# EAGLE design schematic (EAGLE 9.0.0)
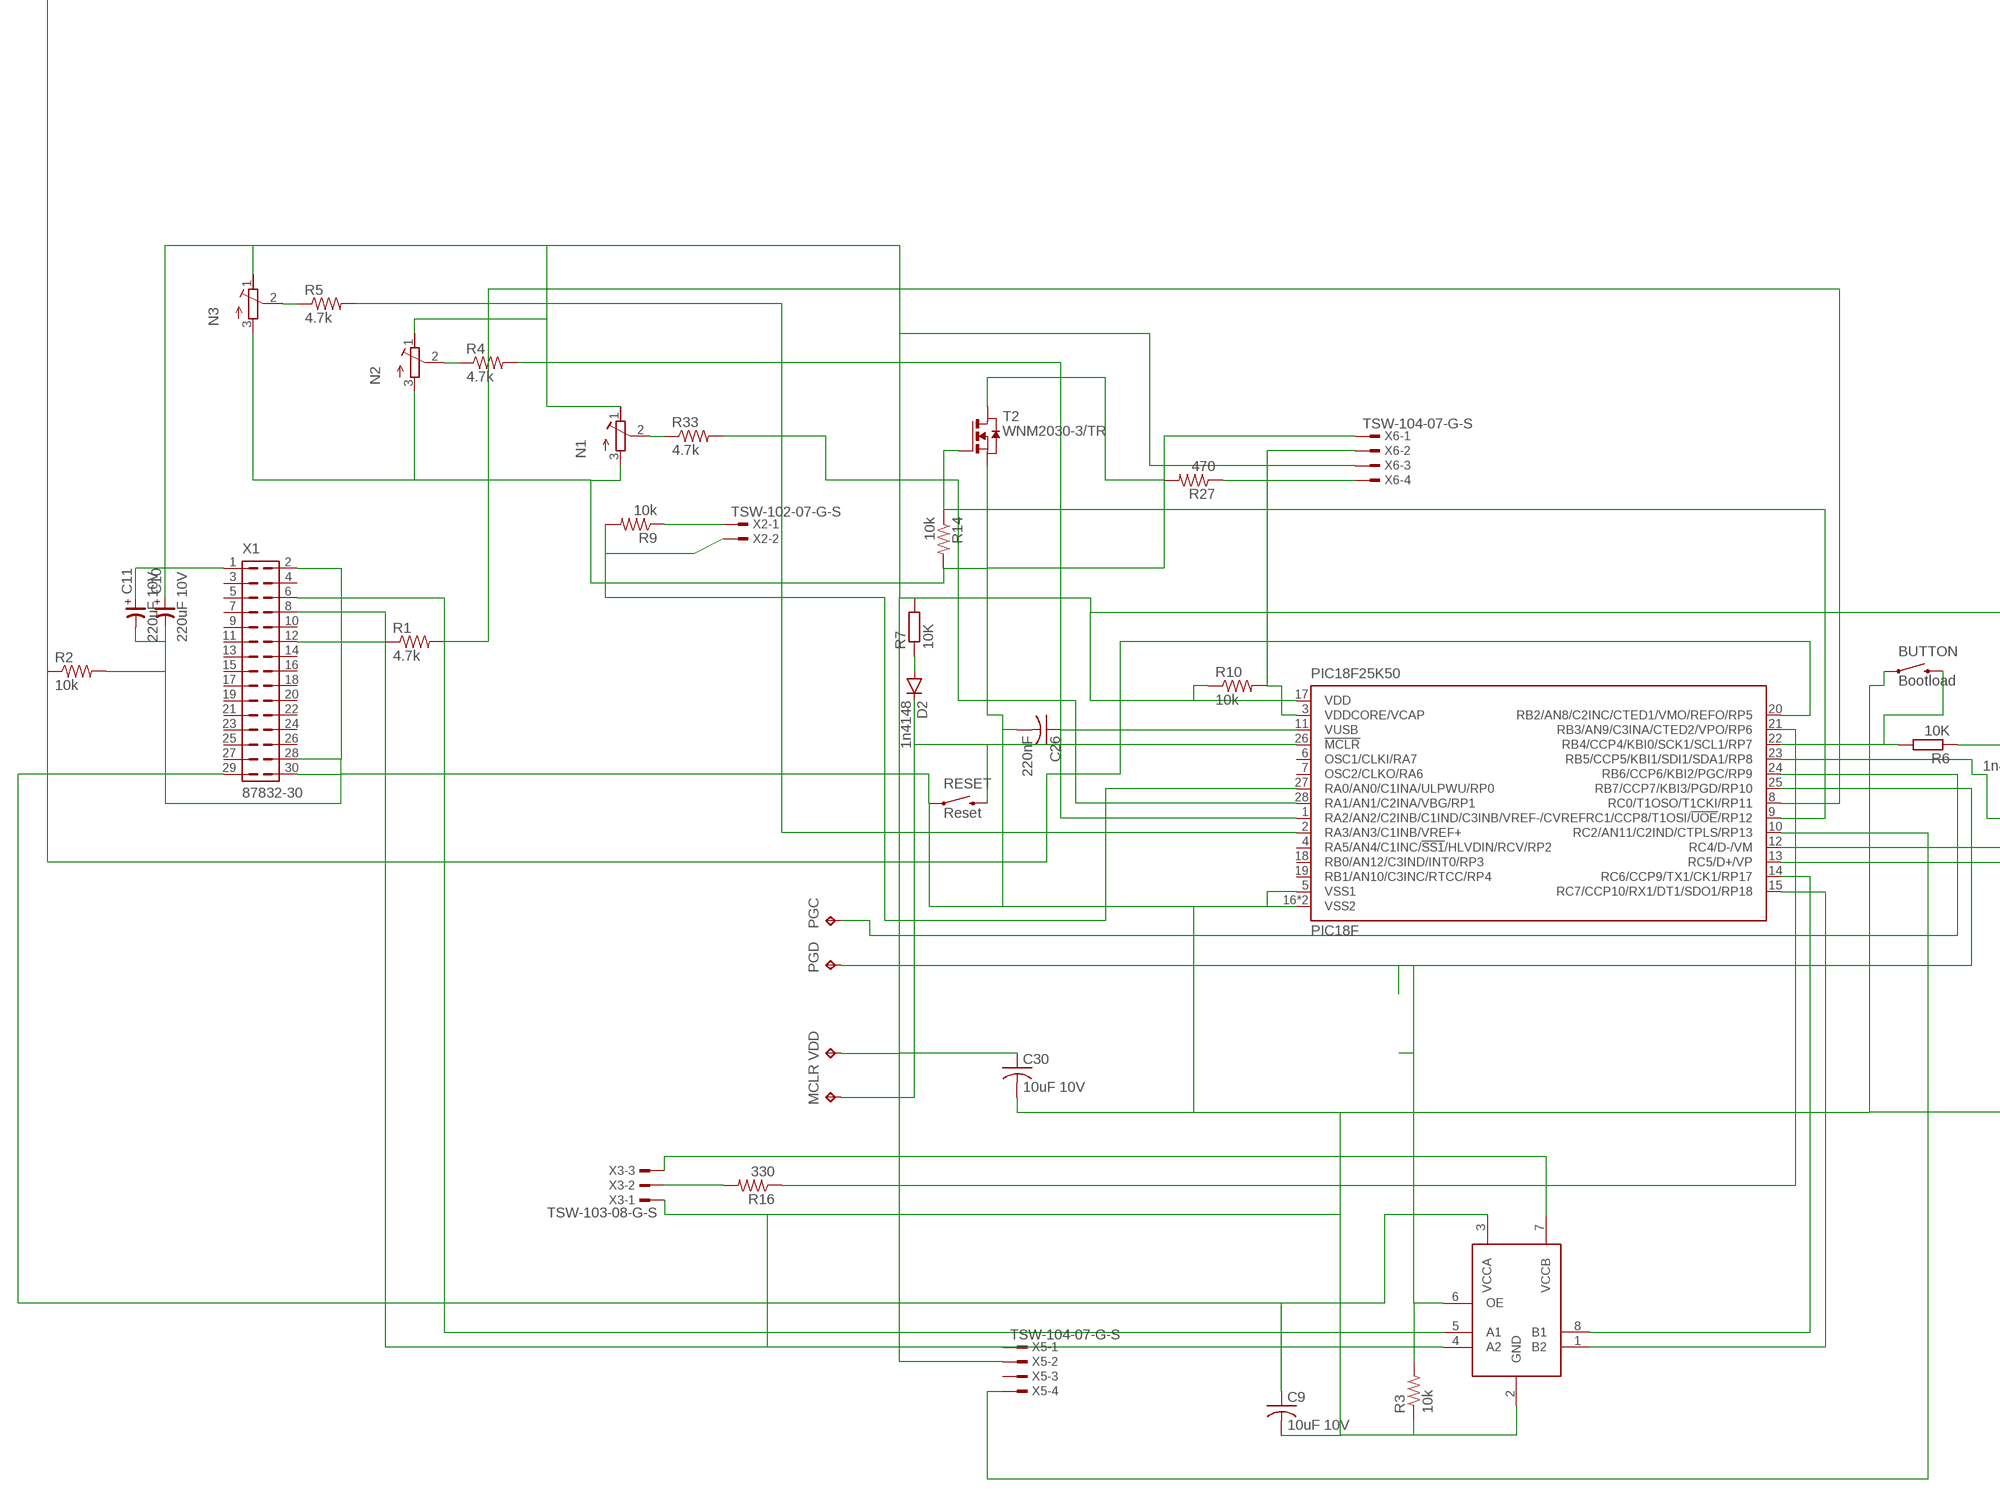
[diagram p0: schematic, sheet 1, part 1 of 2]
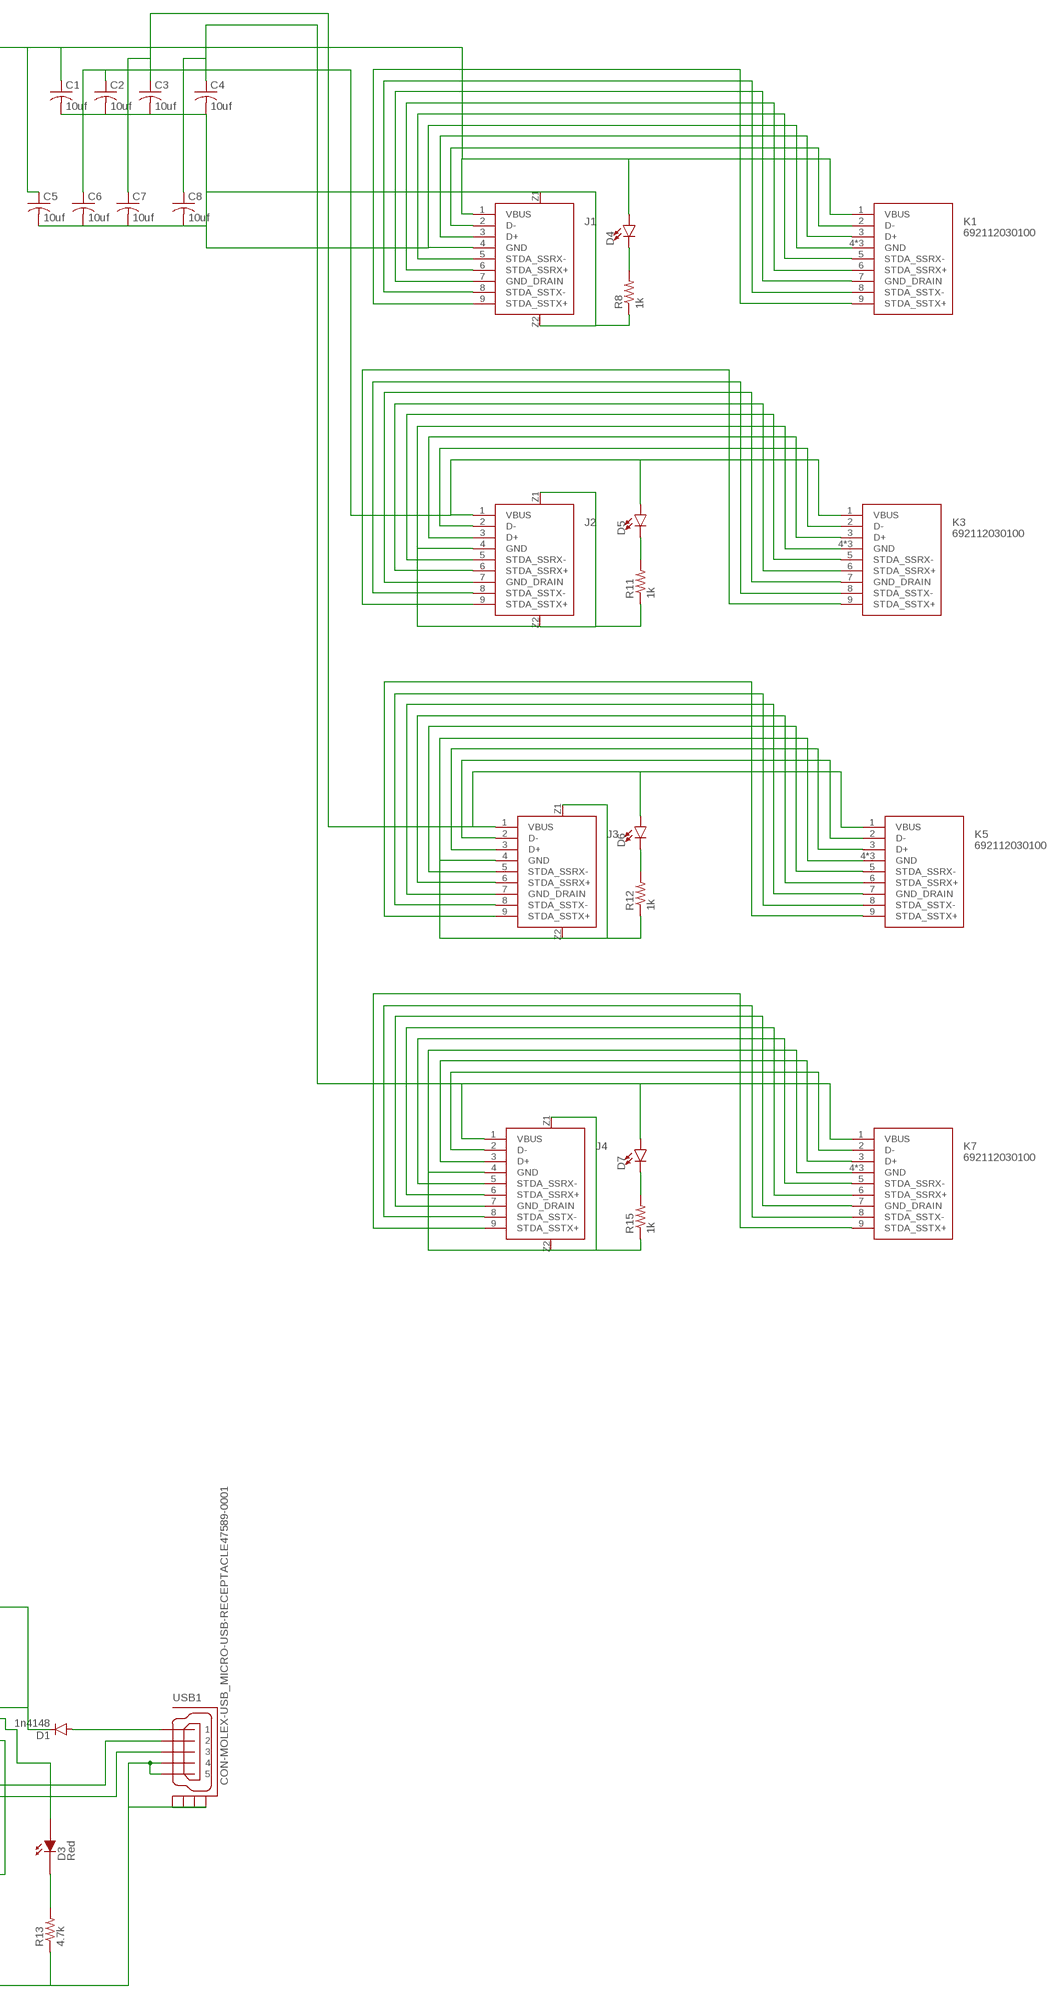
[diagram p1: schematic, sheet 1, part 2 of 2]

## Parts
BUTTON  Bootload  BEAGLEBONE_BLUE_SPARKFUN-ELECTROMECHANICAL_SWITCH-MOMENTARY-2SMD-4.6X2.8MM  [BEAGLEBONE_BLUE_SPARKFUN-ELECTROMECHANICAL_TACTILE_SWITCH_SMD_4.6X2.8MM]
C1  10uf  C-USC0402  [C0402]
C2  10uf  C-USC0402  [C0402]
C3  10uf  C-USC0402  [C0402]
C4  10uf  C-USC0402  [C0402]
C5  10uf  C-USC0402  [C0402]
C6  10uf  C-USC0402  [C0402]
C7  10uf  C-USC0402  [C0402]
C8  10uf  C-USC0402  [C0402]
C9  10uF 10V  ADAFRUIT_C-USC0402  [ADAFRUIT_C0402]
C10  220uF 10V  CP-3258-TE-B  [3528-TE-B]
C11  220uF 10V  CP-3258-TE-B  [3528-TE-B]
C26  220nF  ADAFRUIT_C-USC0402  [ADAFRUIT_C0402]
C30  10uF 10V  ADAFRUIT_C-USC0402  [ADAFRUIT_C0402]
D1  1n4148  SPARKFUN-DISCRETESEMI_DIODESOD123  [SPARKFUN-DISCRETESEMI_SOD-123]
D2  1n4148  SPARKFUN-DISCRETESEMI_DIODESOD123  [SPARKFUN-DISCRETESEMI_SOD-123]
D3  Red  M-PAD-2.1_LEDB  [M-PAD-2.1_0603P]
D4  LED-3MM-NO_SILK  [LED_3MM-NS]
D5  LED-3MM-NO_SILK  [LED_3MM-NS]
D6  LED-3MM-NO_SILK  [LED_3MM-NS]
D7  LED-3MM-NO_SILK  [LED_3MM-NS]
J1  692121430000  [692121430000]
J2  692121430000  [692121430000]
J3  692121430000  [692121430000]
J4  692121430000  [692121430000]
K1  692112030100  [692112030100]
K3  692112030100  [692112030100]
K5  692112030100  [692112030100]
K7  692112030100  [692112030100]
MCLR  TESTPAD_TPTP15SQ  [TESTPAD_TP15SQ]
N1  R-TRIMM3314J  [RTRIM3314J]
N2  R-TRIMM3314J  [RTRIM3314J]
N3  R-TRIMM3314J  [RTRIM3314J]
PGC  TESTPAD_TPTP15SQ  [TESTPAD_TP15SQ]
PGD  TESTPAD_TPTP15SQ  [TESTPAD_TP15SQ]
PIC18F25K50  PIC18F  MICROCHIP_PIC18F26J53ML  [MICROCHIP_QFN28-ML_6X6MM]
R1  4.7k  ADAFRUIT_R-US_R0402  [ADAFRUIT_R0402]
R2  10k  ADAFRUIT_R-US_R0402  [ADAFRUIT_R0402]
R3  10k  R-US_R0402  [R0402]
R4  4.7k  ADAFRUIT_R-US_R0402  [ADAFRUIT_R0402]
R5  4.7k  ADAFRUIT_R-US_R0402  [ADAFRUIT_R0402]
R6  10K  RCL_R-EU_R0402  [RCL_R0402]
R7  10K  RCL_R-EU_R0402  [RCL_R0402]
R8  1k  R-US_R0402  [R0402]
R9  10k  ADAFRUIT_R-US_R0402  [ADAFRUIT_R0402]
R10  10k  R-US_R0402  [R0402]
R11  1k  R-US_R0402  [R0402]
R12  1k  R-US_R0402  [R0402]
R13  4.7k  ADAFRUIT_R-US_R0402  [ADAFRUIT_R0402]
R14  10k  R-US_R0402  [R0402]
R15  1k  R-US_R0402  [R0402]
R16  330  R-US_R0402  [R0402]
R27  470  R-US_R0402  [R0402]
R33  4.7k  ADAFRUIT_R-US_R0402  [ADAFRUIT_R0402]
RESET  Reset  BEAGLEBONE_BLUE_SPARKFUN-ELECTROMECHANICAL_SWITCH-MOMENTARY-2SMD-4.6X2.8MM  [BEAGLEBONE_BLUE_SPARKFUN-ELECTROMECHANICAL_TACTILE_SWITCH_SMD_4.6X2.8MM]
T2  WNM2030-3/TR  NMOSSOT23SOT723  [SOT723]
U1  TXB0102DCUR  [VSSOP8]
USB1  CON-MOLEX-USB_MICRO-USB-RECEPTACLE47589-0001  [CON-MOLEX-USB_47589-0001]
VDD  TESTPAD_TPTP15SQ  [TESTPAD_TP15SQ]
X1  87832-30  [87832-30]
X2  TSW-102-07-G-S  [TSW-102-XX-G-S]
X3  TSW-103-08-G-S  [TSW-103-XX-G-S]
X5  TSW-104-07-G-S  [TSW-104-XX-G-S]
X6  TSW-104-07-G-S  [TSW-104-XX-G-S]

## Nets
GND: BUTTON.1 BUTTON.2 C1.2 C2.2 C3.2 C4.2 C5.2 C6.2 C7.2 C8.2 C9.2 C10.- C11.- C26.2 C30.2 J1.4(GND) J1.Z1 J1.Z2 J2.4(GND) J2.Z1 J2.Z2 J3.4(GND) J3.Z1 J3.Z2 J4.4(GND) J4.Z1 J4.Z2 K1.4(GND) K1.Z1(GND) K1.Z2(GND) K3.4(GND) K3.Z1(GND) K3.Z2(GND) K5.4(GND) K5.Z1(GND) K5.Z2(GND) K7.4(GND) K7.Z1(GND) K7.Z2(GND) N1.3(A) N2.3(A) N3.3(A) PIC18F25K50.5(VSS1) PIC18F25K50.16(VSS2) PIC18F25K50.EXP(VSS2) R2.2 R3.1 R8.1 R11.1 R12.1 R13.1 R14.2 R15.1 RESET.1 RESET.2 T2.2(S) U1.2(GND) USB1.4 USB1.5 USB1.CASING1(GND1) USB1.CASING2(GND2) USB1.CASING3(GND3) USB1.CASING4(GND4) X1.2 X1.28 X1.30 X3.1 X5.1 X6.1
N$1: C1.1 C5.1 D4.A J1.1(VBUS) K1.1(VBUS) PIC18F25K50.20(RB2/AN8/C2INC/CTED1/VMO/REFO/RP5) R2.1
N$2: C2.1 C6.1 D5.A J2.1(VBUS) K3.1(VBUS)
N$2_N: J1.2(D-) K1.2(D-)
N$2_P: J1.3(D+) K1.3(D+)
N$4: R1.1 X1.12
N$5: J2.7(GND_DRAIN) K3.7(GND_DRAIN)
N$5_N: J1.5(STDA_SSRX-) K1.5(STDA_SSRX-)
N$5_P: J1.6(STDA_SSRX+) K1.6(STDA_SSRX+)
N$6: C3.1 C7.1 D6.A J3.1(VBUS) K5.1(VBUS)
N$7: J1.7(GND_DRAIN) K1.7(GND_DRAIN)
N$8: PIC18F25K50.8(RC0/T1OSO/T1CKI/RP11) R1.2
N$8_N: J1.8(STDA_SSTX-) K1.8(STDA_SSTX-)
N$8_P: J1.9(STDA_SSTX+) K1.9(STDA_SSTX+)
N$9: J3.7(GND_DRAIN) K5.7(GND_DRAIN)
N$10: C4.1 C8.1 D7.A J4.1(VBUS) K7.1(VBUS)
N$11: C9.1 U1.3(VCCA) X1.29
N$12: J4.7(GND_DRAIN) K7.7(GND_DRAIN)
N$13: PIC18F25K50.15(RC7/CCP10/RX1/DT1/SDO1/RP18) U1.1(B2)
N$14: PIC18F25K50.28(RA1/AN1/C2INA/VBG/RP1) R33.2
N$15: PIC18F25K50.14(RC6/CCP9/TX1/CK1/RP17) U1.8(B1)
N$16: U1.5(A1) X1.6
N$17: U1.4(A2) X1.8
N$18: PGC.TP PIC18F25K50.24(RB6/CCP6/KBI2/PGC/RP9)
N$19: PGD.TP PIC18F25K50.25(RB7/CCP7/KBI3/PGD/RP10) R3.2 U1.6(OE)
N$20: PIC18F25K50.1(RA2/AN2/C2INB/C1IND/C3INB/VREF-/CVREF) R4.2
N$21: D4.K(C) R8.2
N$21_N: J2.2(D-) K3.2(D-)
N$21_P: J2.3(D+) K3.3(D+)
N$22: N2.2(S) R4.1
N$22_N: J3.2(D-) K5.2(D-)
N$22_P: J3.3(D+) K5.3(D+)
N$23: PIC18F25K50.2(RA3/AN3/C1INB/VREF+) R5.2
N$23_N: J4.2(D-) K7.2(D-)
N$23_P: J4.3(D+) K7.3(D+)
N$24: D5.K(C) R11.2
N$25: R27.2 T2.3(D)
N$26: D3.1(D_IN) PIC18F25K50.23(RB5/CCP5/KBI1/SDI1/SDA1/RP8)
N$27: D3.2(D_OUT) R13.2
N$28: N3.2(S) R5.1
N$29: D6.K(C) R12.2
N$30: D7.K(C) R15.2
N$31: R16.2 X3.2
N$32: PIC18F25K50.21(RB3/AN9/C3INA/CTED2/VPO/RP6) R16.1
N$33: R9.1 X2.1
N$34: PIC18F25K50.27(RA0/AN0/C1INA/ULPWU/RP0) R9.2 X2.2
N$35: PIC18F25K50.9(RC1/CCP8/T1OSI/!UOE!/RP12) R14.1 T2.1(G)
N$38: D1.A USB1.1
N$40: C26.1 PIC18F25K50.11(VUSB)
N$41 [3.3vPower]: C10.+ C11.+ C30.1 D1.C N1.1(E) N2.1(E) N3.1(E) PIC18F25K50.17(VDD) R6.1 R7.2 R10.1 U1.7(VCCB) VDD.TP X1.1 X3.3 X5.2 X6.3
N$42: BUTTON.3 BUTTON.4 PIC18F25K50.22(RB4/CCP4/KBI0/SCK1/SCL1/RP7) R6.2
N$43: D2.A R7.1
N$44: D2.C MCLR.TP PIC18F25K50.26(!MCLR) RESET.3 RESET.4
N$45: PIC18F25K50.10(RC2/AN11/C2IND/CTPLS/RP13) X5.4
N$49: R27.1 X6.4
N$51: N1.2(S) R33.1
N$51_N: J2.5(STDA_SSRX-) K3.5(STDA_SSRX-)
N$51_P: J2.6(STDA_SSRX+) K3.6(STDA_SSRX+)
N$52: PIC18F25K50.3(VDDCORE/VCAP) R10.2 X6.2
N$52_N: J3.5(STDA_SSRX-) K5.5(STDA_SSRX-)
N$52_P: J3.6(STDA_SSRX+) K5.6(STDA_SSRX+)
N$53_N: J4.5(STDA_SSRX-) K7.5(STDA_SSRX-)
N$53_P: J4.6(STDA_SSRX+) K7.6(STDA_SSRX+)
N$81_N: J2.8(STDA_SSTX-) K3.8(STDA_SSTX-)
N$81_P: J2.9(STDA_SSTX+) K3.9(STDA_SSTX+)
N$82_N: J3.8(STDA_SSTX-) K5.8(STDA_SSTX-)
N$82_P: J3.9(STDA_SSTX+) K5.9(STDA_SSTX+)
N$83_N: J4.8(STDA_SSTX-) K7.8(STDA_SSTX-)
N$83_P: J4.9(STDA_SSTX+) K7.9(STDA_SSTX+)
N$85_N: PIC18F25K50.12(RC4/D-/VM) USB1.2
N$85_P: PIC18F25K50.13(RC5/D+/VP) USB1.3
Unconnected: PIC18F25K50.4(RA5/AN4/C1INC/!SS1!/HLVDIN/RCV/RP2) PIC18F25K50.6(OSC1/CLKI/RA7) PIC18F25K50.7(OSC2/CLKO/RA6) PIC18F25K50.18(RB0/AN12/C3IND/INT0/RP3) PIC18F25K50.19(RB1/AN10/C3INC/RTCC/RP4) X1.3 X1.4 X1.5 X1.7 X1.9 X1.10 X1.11 X1.13 X1.14 X1.15 X1.16 X1.17 X1.18 X1.19 X1.20 X1.21 X1.22 X1.23 X1.24 X1.25 X1.26 X1.27 X5.3

## Library data of the parts
BUTTON RESET = schematic:BEAGLEBONE_BLUE_SPARKFUN-ELECTROMECHANICAL_SWITCH-MOMENTARY-2: Various NO switches- pushbuttons, reed, etc; PROD_ID: SWCH-13065
C1-C8 = rcl:C-US: CAPACITOR, American symbol; SPICEPREFIX: C
C9 C26 C30 = schematic:ADAFRUIT_C-US: CAPACITOR, American symbol
C10 C11 = cap-master:CP-: POLARIZED CAP
D1 D2 = schematic:SPARKFUN-DISCRETESEMI_DIODE: Diode These are standard reverse protection diodes and small signal diodes. SMA package can handle up to about 1A. SOD-323 can handle about 200mA. What the SOD-323 package when ordering, there are some mfgs out there that are 5-pin packages.
D3 = schematic:M-PAD-2.1_LED: LED's in various packages
D4-D7 = SparkFun-LED:LED: LED (Generic) Standard schematic elements and footprints for 5mm, 3mm, 1206, and 0603 sized LEDs. Generic LEDs with no color specified.
J1-J4 = Wurth_Elektronik_Electromechanic_Input-Output_Connectors_rev16b:692121430000: WR-COM USB 3.0 Vertical Type A Receptacle Through hole=>Code : Con_I-O_COM_USB-3.0_A_692121430000 <http://katalog.we-online.de/media/images/eican/Con_I-O_COM_USB-3.0_A_692121430000_pf2.jpg> Details see: http://katalog.we-online.de/en/em/692_121_430_000 Created 2014-07-09, Karrer Zheng 2014 (C) Würth Elektronik
K1 K3 K5 K7 = Wuerth_Elektronik_eiCan_Communication_Connectors_STENCIL:692112030100: WR-COM USB 3.0 SMT PLUG WITH CLIPTYPE A
MCLR PGC PGD VDD = schematic:TESTPAD_TP: Test pad
N1-N3 = rcl:R-TRIMM: Trimm resistor; SPICEMODEL: X; SPICEPREFIXL: POT
PIC18F25K50 = schematic:MICROCHIP_PIC18F2*J53: PIC18F47J53 Family High-Performance USB Microcontrollers with nanoWatt XLP Technology Source: Data sheet <http://ww1.microchip.com/downloads/en/DeviceDoc/39964B.pdf>; MPN: PIC18F26J53-I/ML; OC_FARNELL: unknown; OC_NEWARK: 63R7829
R1 R2 R4 R5 R9 R13 R33 = schematic:ADAFRUIT_R-US_: RESISTOR, American symbol
R3 R8 R10-R12 R14-R16 R27 = rcl:R-US_: RESISTOR, American symbol
R6 R7 = schematic:RCL_R-EU_: RESISTOR, European symbol
T2 = zetex:NMOSSOT23: MOS FET
U1 = electronic-labs:TXB0102DCUR
USB1 = schematic:CON-MOLEX-USB_MICRO-USB-RECEPTACLE: MICRO USB RECEPTACLES Micro-USB Receptacles, SMT, Lead-Free from MOLEX <http://www.molex.com/>. (C) 2014 Tomasz Boleslaw CEDRO, cederom@tlen.pl, http://www.tomek.cedro.info. Version 0.1 (2014-01-17): Initial release. Version 0.2 (2014-02-06): Updated 47589-0001 footprint pins/pads/milling. Following devices are included: 1. 47589-0001 Micro-USB AB Receptacle, Bottom Mount, SMT, Lead-Free <http://www.molex.com/molex/products/datasheet.jsp?part=active/0475890001_IO_CONNECTORS.xml> (Technical Drawing <http://www.molex.com/pdm_docs/sd/475890001_sd.pdf>).
X1 = con-molex:87832-30: Milli-Grid Header 2.00mm (.079") Pitch
X2 = con-samtec:TSW-102-*-G-S: THROUGH-HOLE .025" SQ POST HEADER Source: Samtec TSW.pdf; MF: Samtec Inc.; MPN: TSW-102-07-G-S
X3 = con-samtec:TSW-103-*-G-S: THROUGH-HOLE .025" SQ POST HEADER Source: Samtec TSW.pdf; MF: Samtec Inc.; MPN: TSW-103-07-G-S
X5 X6 = con-samtec:TSW-104-*-G-S: THROUGH-HOLE .025" SQ POST HEADER Source: Samtec TSW.pdf; MF: Samtec Inc.; MPN: TSW-104-07-G-S

## Net classes
1 Power: width 0.965 mm
3 3.3vPower: width 0.406 mm

## Board
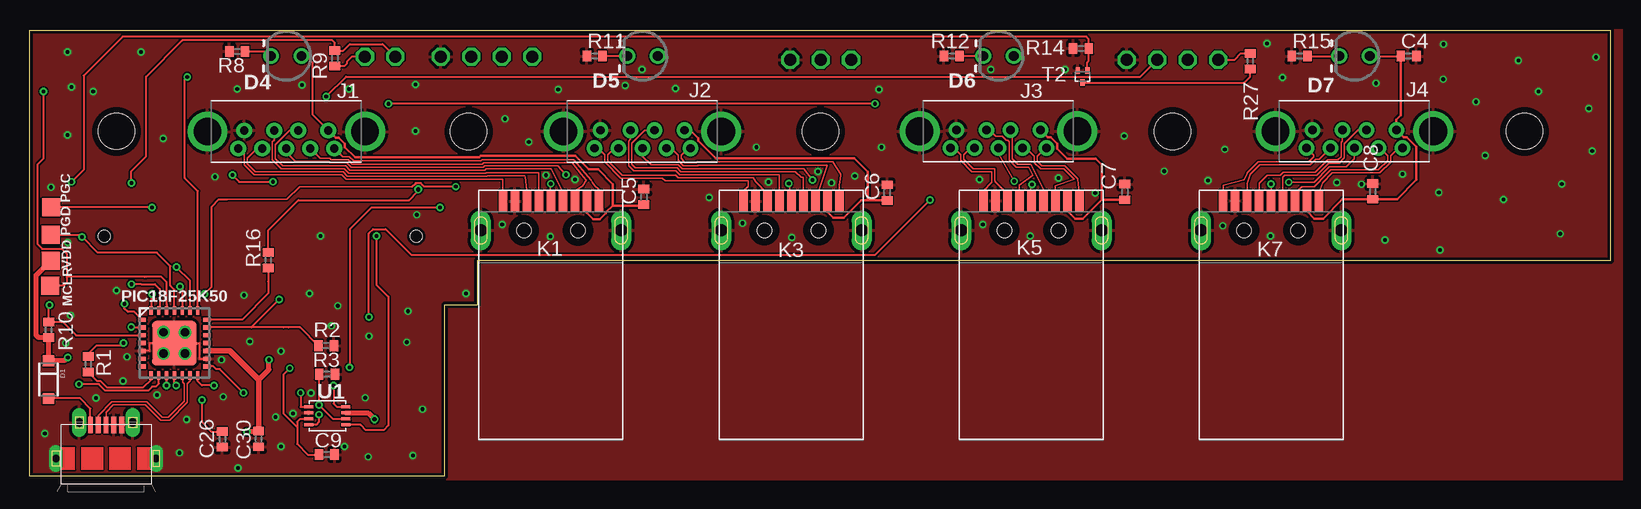
[diagram p2: board, top side]
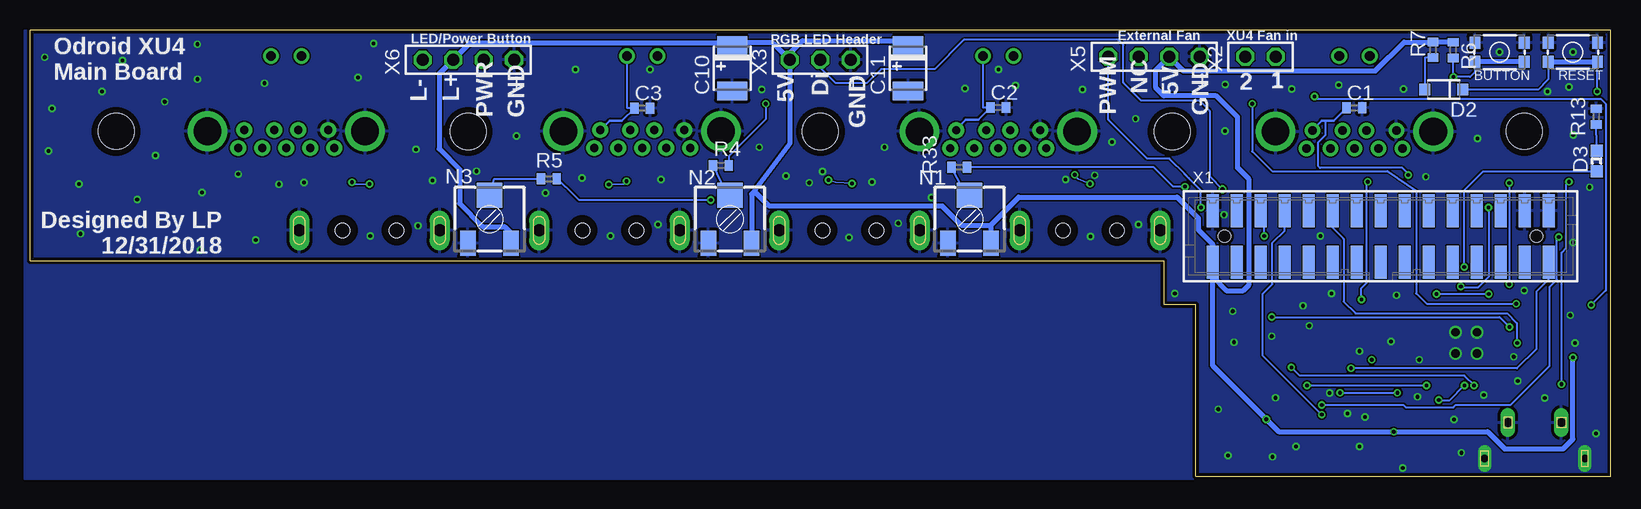
[diagram p3: board, bottom side, seen from below]

Size 131.72 x 37.17 mm. Coordinates in mm from the lower left corner, seen from the top.
Outline: 0,37.17 131.72,37.17 131.72,17.94 37.25,17.94 37.25,14.3 34.57,14.3 34.57,0 0,0 0,37.17
Copper layers (1*16): Top 0.035mm / dielectric 1.5mm / Bottom 0.035mm
Design rules "LP_PCBOrder": minimum track width 5mil, minimum drill 12mil, track to track 5mil, track to pad 5mil, pad to pad 5mil, via to via 5mil, smd to smd 0mil, copper to edge 10mil, drill to drill 10mil, minimum pad ring 10mil, minimum via ring 6mil, stop-mask expansion 2mil, vias tented up to drill 17mil, thermal gap 10mil
Holes 3 mm at 95.21,28.71 65.88,28.72 36.55,28.71 7.21,28.73 124.55,28.73
tRestrict: area 105.4,20.2 to 106,20.8; area 100.9,20.2 to 101.5,20.8; area 85.4,20.2 to 86,20.8; area 80.9,20.2 to 81.5,20.8; area 65.4,20.2 to 66,20.8; area 60.9,20.2 to 61.5,20.8; area 45.4,20.2 to 46,20.8; area 40.8,20.2 to 41.5,20.8; area 6.9,28.4 to 7.5,29; area 36.3,28.4 to 36.9,29; area 65.6,28.4 to 66.2,29; area 94.9,28.4 to 95.5,29; 1 more areas
bRestrict: area 105.4,20.2 to 106,20.8; area 100.9,20.2 to 101.5,20.8; area 85.4,20.2 to 86,20.8; area 80.9,20.2 to 81.5,20.8; area 65.4,20.2 to 66,20.8; area 60.9,20.2 to 61.5,20.8; area 45.4,20.2 to 46,20.8; area 40.8,20.2 to 41.5,20.8; area 6.9,28.4 to 7.5,29; area 36.3,28.4 to 36.9,29; area 65.6,28.4 to 66.2,29; area 94.9,28.4 to 95.5,29; 1 more areas

### Footprints (pad centres in the part's own frame; a part is rotated, then mirrored left to right if it is on the bottom)
BEAGLEBONE_BLUE_SPARKFUN-ELECTROMECHANICAL_TACTILE_SWITCH_SMD_4.6X2.8MM = smd 0.9 x 1: 1 -2.05,-0.8; 2 2.05,-0.8; 3 2.05,0.8; 4 -2.05,0.8
C0402 = smd 0.7 x 0.9: 1 -0.65,0; 2 0.65,0
ADAFRUIT_C0402 = smd 0.7 x 0.9: 1 -0.65,0; 2 0.65,0
3528-TE-B = smd 1.524 x 2.54: + 1.905,0; - -1.905,0
SPARKFUN-DISCRETESEMI_SOD-123 = smd 0.9 x 0.95: A 1.575,0; C -1.575,0
M-PAD-2.1_0603P = smd 1 x 1: 1 -0.85,0; 2 0.85,0
LED_3MM-NS = drill 0.813: A -1.27,0; K 1.27,0
692121430000 = drill 0.7 pad 1.3: 1 -3.5,-0.1; 2 -1,-0.1; 3 1,-0.1; 4 3.5,-0.1; 5 4,1.4; 6 2,1.4; 7 0,1.4; 8 -2,1.4; 9 -4,1.4 | drill 2.3: Z1 -6.57,0; Z2 6.57,0
692112030100 = smd 0.7 x 1.8: 1 -3,0; 2 -1,0; 3 1,0; 4 3,0; 5 4,0; 6 2,0; 7 0,0; 8 -2,0; 9 -4,0 | drill 1 pad 1.676 long: Z1 5.85,2.45; Z2 -5.85,2.45 | hole 1.2: 2.25,2.45; -2.25,2.45
TESTPAD_TP15SQ = smd 1.5 x 1.5: TP 0,0
RTRIM3314J = smd 1.3 x 2.1: 1 1.8,-2; 3 -1.8,-2 | smd 2.1 x 2.1: 2 0,2
MICROCHIP_QFN28-ML_6X6MM = smd 0.7 x 0.35: 1 -2.7,1.95; 2 -2.7,1.3; 3 -2.7,0.65; 4 -2.7,0; 5 -2.7,-0.65; 6 -2.7,-1.3; 7 -2.7,-1.95; 15 2.7,-1.95; 16 2.7,-1.3; 17 2.7,-0.65; 18 2.7,0; 19 2.7,0.65; 20 2.7,1.3; 21 2.7,1.95 | smd 0.35 x 0.7: 8 -1.95,-2.7; 9 -1.3,-2.7; 10 -0.65,-2.7; 11 0,-2.7; 12 0.65,-2.7; 13 1.3,-2.7; 14 1.95,-2.7; 22 1.95,2.7; 23 1.3,2.7; 24 0.65,2.7; 25 0,2.7; 26 -0.65,2.7; 27 -1.3,2.7; 28 -1.95,2.7 | smd 3.7 x 3.7: EXP 0,0
ADAFRUIT_R0402 = smd 0.7 x 0.9: 1 -0.65,0; 2 0.65,0
R0402 = smd 0.7 x 0.9: 1 -0.65,0; 2 0.65,0
RCL_R0402 = smd 0.7 x 0.9: 1 -0.65,0; 2 0.65,0
SOT723 = smd 0.36 x 0.52: 1 -0.4,-0.5; 2 0.4,-0.5; 3 0,0.5
VSSOP8 = smd 0.25 x 0.75: 1 -1.27,-1.83; 2 -0.77,-1.83; 3 -0.27,-1.83; 4 0.23,-1.83; 5 0.23,1.27; 6 -0.27,1.27; 7 -0.77,1.27; 8 -1.27,1.27
CON-MOLEX-USB_47589-0001 = smd 1.35 x 0.4: 1 2.8,1.297; 2 2.8,0.65; 3 2.8,0; 4 2.8,-0.65; 5 2.8,-1.3 | drill 0.6 pad 0.95 long: CASING1 0,4.175; CASING2 0,-4.175 | drill 0.7 pad 1.1 long: CASING3 3,2.228; CASING4 3,-2.225
87832-30 = smd 1 x 2.75: 1 -14,-2.15; 2 -14,2.15; 3 -12,-2.15; 4 -12,2.15; 5 -10,-2.15; 6 -10,2.15; 7 -8,-2.15; 8 -8,2.15; 9 -6,-2.15; 10 -6,2.15; 11 -4,-2.15; 12 -4,2.15; 13 -2,-2.15; 14 -2,2.15; 15 0,-2.15; 16 0,2.15; 17 2,-2.15; 18 2,2.15; 19 4,-2.15; 20 4,2.15; 21 6,-2.15; 22 6,2.15; 23 8,-2.15; 24 8,2.15; 25 10,-2.15; 26 10,2.15; 27 12,-2.15; 28 12,2.15; 29 14,-2.15; 30 14,2.15 | hole 1: -13,0; 13,0
TSW-102-XX-G-S = drill 1 pad 1.5 octagon: 1 1.27,0; 2 -1.27,0
TSW-103-XX-G-S = drill 1 pad 1.5 octagon: 1 2.54,0; 2 0,0; 3 -2.54,0
TSW-104-XX-G-S = drill 1 pad 1.5 octagon: 1 3.81,0; 2 1.27,0; 3 -1.27,0; 4 -3.81,0

### Placement (x,y rotation side)
BUTTON  9.26,35.32 180 bottom
C1  21.36,30.69 0 bottom
C2  51.04,30.71 0 bottom
C3  80.7,30.66 0 bottom
C4  114.88,35 0 top
C5  51.16,23.27 90 top
C6  71.43,23.63 90 top
C7  91.24,23.68 90 top
C8  111.9,23.72 90 top
C9  24.73,1.79 0 top
C10  73.2,34 90 bottom
C11  58.55,34 90 bottom
C26  16.03,3.06 270 top
C30  19.05,3.09 270 top
D1  1.53,8.04 270 top
D2  13.91,32.21 180 bottom
D3  1.18,26.25 90 bottom
D4  21.36,35 180 top
D5  51.03,35 180 top
D6  80.71,35 180 top
D7  110.37,35 180 top
J1  21.36,28.71 180 top
J2  51.03,28.72 180 top
J3  80.71,28.73 180 top
J4  110.37,28.74 180 top
K1  43.4,22.92 180 top
K3  63.44,22.92 180 top
K5  83.44,22.93 180 top
K7  103.43,22.93 180 top
MCLR  1.7,15.86 0 top
N1  53.43,21.4 0 bottom
N2  73.4,21.4 0 bottom
N3  93.42,21.4 0 bottom
PGC  1.77,22.38 0 top
PGD  1.75,20.11 0 top
PIC18F25K50  12.03,11.08 0 top
R1  4.85,9.31 270 top
R2  24.68,10.87 0 top
R3  24.75,8.5 180 top
R4  74.14,25.89 0 bottom
R5  88.48,24.77 0 bottom
R6  13.13,35.5 270 bottom
R7  14.81,35.52 90 bottom
R8  17.27,35.38 0 top
R9  25.4,34.81 90 top
R10  1.55,12.19 90 top
R11  47.05,35 0 top
R12  76.8,35 0 top
R13  1.2,29.96 270 bottom
R14  87.58,35.63 180 top
R15  105.8,35 0 top
R16  19.85,18 90 top
R27  101.69,34.57 270 top
R33  54.29,25.74 0 bottom
RESET  3.16,35.33 180 bottom
T2  87.71,33.3 180 top
U1  25.04,4.5 270 top
USB1  6.34,1.46 90 top
VDD  1.72,17.96 0 top
X1  19.18,19.98 0 bottom
X2  29.18,34.95 0 bottom
X3  65.88,34.69 0 bottom
X5  38.05,34.95 0 bottom
X6  95.2,34.69 0 bottom

### Tracks (layer width: path | path; a pad name or v marks a point on that pad's centre or on a via)
GND  (via drill 0.3 pad 0.61, 0.7 pad 0.81)
  Top 0.146: PIC18F25K50.16 14.12,9.78 14.12,11.08 PIC18F25K50.EXP 9.96,11.08 9.96,10.43 PIC18F25K50.5
  Top 0.457: PIC18F25K50.EXP 11.38,10.43 11.15,10.43 11.8,9.78
  Bottom 0.146: X1.30 4.89,22.13
  other vias: 80.06,33.87 51,33.87 26.21,2.48 15.95,9.69 32.22,21.78 86.26,33.87 3.14,35.34 56.61,23.2 17.27,32.25 20.93,10.4 20.93,2.48 110.96,24.32 1.75,24.07 18.31,11.21 7.2,15.47 3.37,13.4 2.97,11.09 8.08,9.94 5.5,6.52 13.06,4.72 12.45,1.94 1.23,3.56 3.47,32.41 5.27,32.05 11.1,28.13 22.66,32.59 32.13,28.77 39.59,29.78 44.02,32.22 49.61,32.55 53.8,32.3 68.73,25.02 66.79,24.45 61.55,24.5 45.42,24.73 42.99,25.07 41.57,27.85 103.37,20 108.89,24.47 114.38,25.16 104.38,33.22 112.18,32.74 117.77,33.07 103.09,36.04 99.57,27.23 91.19,28.33 112.91,19.67 117.4,23.63 122.78,23.04 127.65,24.33 127.52,20.19 121.27,26.71 120.5,31.19 125.72,32.05 129.9,30.63 130.19,27.09 130.49,34.9 124.03,34.63 117.78,35.98 31.9,1.7 31.39,11.15 36.33,15.23 26.58,32.26 15.41,24.94 3.12,28.41 9.26,35.33 3.15,19.47 10.58,6.76 24.2,20 88.78,23.6 85.71,24.84 94.53,25.4 83.35,20 43.36,19.95 63.48,19.88 65.67,25.39 32.7,5.58 60.53,27.41 70.95,27.41 70.75,32.22 117.51,18.85 23.28,15.21 25.12,12.52 27.94,6.53 7.75,7.92 11.14,11.99 12.92,11.99 11.14,10.21 12.92,10.21 28.24,11.66 20.47,4.93 17.32,0.69 31.5,13.74 23.42,6.93 21.92,5.21 16.1,6.6 17.84,15.06 32.12,32.64 25.64,14.2 98.17,24.63 99.39,20.87 79.39,20.97 79.14,24.73 59.38,21.07 39.36,20.97 28.18,1.61
  pour Top: 0,37.17 0,-0.28 132.69,-0.28 132.69,37.17
  pour Bottom: 0,37.17 0,-0.28 132.16,-0.28 132.16,37.17
N$1  (via drill 0.3)
  Top 0.127: 16.87,25.03 v16.87,25.08
  Top 0.146: 21.55,12.38 21.11,12.38 | J1.1 23.57,30.1 23.57,34.44
  Top 0.152: 18.44,12.38 21.11,12.38 22.52,12.38 R2.1 | 18.44,12.38 PIC18F25K50.20 | 23.57,34.44 23.01,35 D4.A | v16.87,25.08 17.42,24.52 v20.24,24.52 | v20.78,14.72 18.44,12.38
  Top 0.229: K1.1 46.4,21.94 46.94,21.41 47.49,21.41 48,21.92 48,21.97 48.55,22.52 | 48.55,22.52 51.07,22.52 C5.1 | J1.1 25.47,28.2 25.73,28.2 26.25,27.68 26.25,27.42 27.1,26.56 37.45,26.56 37.56,26.68 45.45,26.68 46.58,25.56 47.35,25.56 48.55,24.33 48.55,22.52
  Bottom 0.146: v20.78,14.72 20.78,15.66 20.35,16.09 20.35,24.42 v20.24,24.52
  Bottom 0.152: 23.77,29.63 23.77,28.41 24.41,27.77 24.41,25.87 24.23,25.69 17.37,25.69 16.87,25.18 v16.87,25.08
  Bottom 0.229: C1.1 23.06,29.63 23.77,29.63 24.08,29.63 24.86,28.85 J1.1
N$2
  Top 0.229: K3.1 66.44,22.01 66.93,21.53 67.82,21.53 69.27,22.98 69.8,22.98 | 69.8,22.98 C6.1 | J2.1 55.04,28.82 55.7,28.15 55.7,27.93 57.16,26.48 68.67,26.48 69.8,25.35 69.8,22.98
  Bottom 0.146: C2.1 52.3,30.71 D5.A
  Bottom 0.229: C2.1 52.7,29.7 53.76,29.7 54.53,28.93 J2.1
N$2_N
  Top 0.127: J1.2 21.64,28.81 20.45,27.63 20.45,26.46 21.06,25.85 26.31,25.85 26.66,25.5 37.89,25.5 38,25.62 43.44,25.62 44.4,23.65 K1.2
N$2_P
  Top 0.127: J1.3 20.36,28 20.2,27.84 20.2,26.35 20.95,25.6 26.2,25.6 26.56,25.24 37.99,25.24 38.02,25.27 42.4,25.27 K1.3
N$4  (via drill 0.3 pad 0.61)
  Top 0.146: v7.79,11.09 7.57,10.87 5.54,10.87 4.85,10.19 R1.1
  Bottom 0.146: X1.12 23.18,21.95 22.99,22.13 22.99,22.32 | v7.79,11.09 7.79,11.11 7.82,11.15 7.82,12.74 8.64,13.55 21.26,13.55 22.25,14.54 22.25,19.77 23.18,20.7 X1.12 | X1.12 22.99,22.32 | 22.99,22.32 22.99,22.63 | 23.18,20.84 X1.12
N$5  (via drill 0.3 pad 0.61)
  Top 0.127: K3.7 63.32,23.04 63.32,24.29 v63.22,24.39 | J2.7 51.03,26.66 51.77,25.93 54.03,25.93 54.35,25.61 64.46,25.61 v65.2,24.68
  Bottom 0.127: v63.22,24.39 64.59,24.5 65.18,24.66 v65.2,24.68
N$5_N
  Top 0.127: J1.5 17.84,26.83 17.84,25.92 18.67,25.09 25.99,25.09 26.35,24.74 39.39,24.74 K1.5
N$5_P
  Top 0.127: K1.6 41.4,23.84 41.28,24.96 41.23,25.01 38.12,25.01 38.1,24.99 26.45,24.99 26.1,25.35 18.78,25.35 18.09,26.03 18.09,26.47 18.93,27.31 J1.6
N$6
  Top 0.229: K5.1 86.44,22.12 87.11,21.46 87.73,21.46 89.3,23.03 | 89.3,23.03 C7.1 | J3.1 84.82,28.22 85.08,28.22 85.6,27.7 85.6,27.29 86.42,26.46 88.81,26.46 89.32,25.94 89.32,23.37 89.3,23.35 89.3,23.03
  Bottom 0.146: C3.1 81.98,30.66 D6.A | D6.A
  Bottom 0.229: C3.1 82.4,29.61 83.43,29.61 J3.1
N$7  (via drill 0.3 pad 0.61)
  Top 0.127: K1.7 43.4,23.84 43.36,23.93 43.38,24.31 v43.4,24.36 | J1.7 21.36,26.99 22.1,26.24 24.88,26.24 25.01,26.11 26.41,26.11 26.77,25.75 37.78,25.75 37.9,25.87 43.96,25.87 v44.67,25.11
  Bottom 0.127: v43.4,24.36 44.39,24.76 v44.67,25.11
N$8
  Top 0.146: PIC18F25K50.8 10.08,8.66
  Top 0.152: R1.2 5.58,7.93 5.85,7.93 6.39,7.4 9.45,7.4 10.08,8.04 PIC18F25K50.8
N$8_N
  Top 0.127: K1.8 45.4,23.74 46.06,24.2 46.35,24.64 45.94,25.15 45.17,26.12 37.79,26.12 37.68,26.01 26.87,26.01 26.52,26.36 25.12,26.36 24.98,26.5 24.17,26.5 J1.8
N$8_P
  Top 0.127: K1.9 47.4,23.91 47.07,24.18 46.86,24.49 46.76,24.64 46.5,24.95 45.33,26.38 37.69,26.38 37.57,26.26 26.98,26.26 26.62,26.62 26.05,26.62 J1.9
N$9  (via drill 0.3 pad 0.61)
  Top 0.127: K5.7 83.39,22.99 83.39,24.21 v83.49,24.31 | v82.02,24.57 80.71,26.88 J3.7
  Bottom 0.127: v83.49,24.31 82.24,24.31 82.02,24.53 v82.02,24.57
N$10
  Top 0.127: D7.A
  Top 0.146: D7.A C4.1
  Top 0.229: K7.1 106.43,22.05 107.02,21.46 107.76,21.46 109.37,23.07 C8.1 113.95,23.07 115.54,24.68 115.54,27.43 114.74,28.23 114.48,28.23 J4.1 113.87,29.71 114.23,30.07 C4.1
N$11  (via drill 0.3 pad 0.61)
  Top 0.146: 22.25,4.08 22.25,4.51 22.51,4.77 U1.3 | 22.25,4.08 22.25,2.68 23.14,1.79 C9.1 | v21.64,8.98 21.11,8.45 21.11,5.22 22.25,4.08
  Bottom 0.127: X1.29
  Bottom 0.146: v21.64,8.98 7.82,8.98 6.18,10.62 6.18,15.4 5.18,16.4 X1.29
N$12  (via drill 0.3 pad 0.61)
  Top 0.127: K7.7 103.43,24.23 | 103.43,24.23 | 103.43,24.23 103.43,24.24 v103.43,24.33 | J4.7 110.37,26.45 109.69,25.77 108.29,25.77 107,24.49 v104.89,24.49
  Bottom 0.127: v103.43,24.33 104.67,24.33 104.82,24.49 v104.89,24.49
N$13  (via drill 0.3 pad 0.61)
  Top 0.146: v22.56,6.95 22.56,5.77 U1.1
  Top 0.152: PIC18F25K50.15 15.29,9.13 15.52,8.9 15.82,8.9 v17.78,6.95
  Bottom 0.146: v22.56,6.95 v17.78,6.95
N$14  (via drill 0.3 pad 0.61)
  Top 0.127: 31.83,24.12 22.47,24.12 21.4,23.05 16.41,23.05 15.71,23.05
  Top 0.146: v10.16,15.18 10.08,15.1 PIC18F25K50.28 | v35.47,24.12 32.87,24.12 32.57,24.42 32.13,24.42 31.83,24.12 | v14.53,15.18 15.14,15.79 15.14,22.44 15.75,23.05 16.41,23.05
  Bottom 0.146: v14.53,15.18 v10.16,15.18 | R33.2 38.1,25.74 36.47,24.12 v35.47,24.12
N$15  (via drill 0.3 pad 0.61)
  Top 0.146: v25.3,7.56 25.3,6.03 25.57,5.77 U1.8
  Top 0.152: v15.34,7.56 14.33,7.56 13.98,7.9 PIC18F25K50.14
  Bottom 0.146: v25.3,7.56 v15.34,7.56
N$16  (via drill 0.3 pad 0.61)
  Top 0.146: U1.5 27.55,4.27 27.99,3.82 29.46,3.82 29.87,4.23 29.87,14.95 28.87,15.95 v28.87,20
  Bottom 0.146: v28.87,20 28.87,20.96 29.18,21.27 X1.6 | X1.6
N$17  (via drill 0.3 pad 0.61)
  Top 0.146: v24.08,5.12 24.08,4.51 23.84,4.27 U1.4
  Bottom 0.127: X1.8
  Bottom 0.146: X1.8 27.18,20.46 28.18,19.45 28.18,16 28.98,15.2 28.98,10.02 v24.08,5.12
N$18  (via drill 0.3 pad 0.61)
  Top 0.146: v12.5,15.79 12.68,15.6 PIC18F25K50.24 | v10.18,22.39 v10.17,22.38 PGC.TP
  Bottom 0.146: v12.5,15.79 12.42,15.71 11.07,15.71 10.18,16.61 v10.18,22.39
N$19  (via drill 0.3 pad 0.61)
  Top 0.146: R3.2 24.1,5.95 v24.08,5.93 25.24,4.77 U1.6 | PIC18F25K50.25 12.03,15.53 11.7,15.87 11.7,17.49 10.57,18.63 5.63,18.63 v4.33,19.93 4.15,20.11 PGD.TP
  Bottom 0.146: v24.08,5.93 17.27,5.93 17.07,5.73 13.11,5.73 12.9,5.93 8.33,5.93 5.08,9.18 5.08,15.77 4.48,16.37 4.48,19.78 v4.33,19.93
N$20  (via drill 0.3 pad 0.61)
  Top 0.146: v70.41,31.03 v29.87,31.03 | PIC18F25K50.1 8.69,13.68 8.15,13.68 7.87,13.96 v7.87,14.36
  Bottom 0.146: v29.87,31.03 29.87,27.06 28.22,25.41 18.59,25.41 16.22,23.78 16.22,15.23 15.34,14.36 v7.87,14.36 | v70.41,31.03 70.41,29.74 73.49,26.66 R4.2
N$21
  Top 0.152: R8.2 19.71,35.38 D4.K
N$21_N
  Top 0.127: J2.2 51.23,28.82 50.14,27.72 50.14,25.97 50.43,25.68 53.93,25.68 54.24,25.36 63.78,25.36 64.25,24.89 64.43,24.89 64.44,23.87 K3.2
N$21_P
  Top 0.127: J2.3 50.03,28.06 49.89,27.91 49.89,25.87 50.33,25.42 53.82,25.42 54.14,25.11 62.43,25.11 K3.3
N$22
  Bottom 0.146: N2.2 73.79,23.8 R4.1
N$22_N
  Top 0.127: J3.2 81.85,28.69 81.85,26.45 82.3,26 83.4,26 84.44,23.95 K5.2
N$22_P
  Top 0.127: K5.3 82.44,24.22 83.57,25.06 83.23,25.75 82.2,25.75 81.6,26.35 81.6,27.86 81.46,27.99 81.36,27.99 81.04,28.31 80.49,28.31 79.97,28.83 J3.3
N$23  (via drill 0.3 pad 0.61)
  Top 0.146: v8.43,12.43 8.48,12.38 PIC18F25K50.2 | v75,23 70.42,18.43 31.79,18.43 29.63,20.59 28.6,20.59 28.24,20.23 v28.24,13.25
  Bottom 0.146: v28.24,13.25 9.25,13.25 v8.43,12.43 | v75,23 85.97,23 86.83,23.86 R5.2
N$23_N
  Top 0.127: J4.2 110.67,28.84 109.52,27.69 109.53,26.53 109.1,26.09 108.24,26.09 107.21,25.05 104.54,25.05 104.38,24.89 104.38,22.98 K7.2
N$23_P
  Top 0.127: J4.3 109.37,27.9 109.26,27.82 109.26,27.79 109.26,26.63 108.98,26.34 108.14,26.34 107.1,25.3 104.44,25.3 104.2,25.07 103.11,25.07 102.43,24.39 K7.3
N$24
  Top 0.146: D5.K R11.2
N$25
  Top 0.146: T2.3 101.19,32.79 101.69,33.29 R27.2
N$26  (via drill 0.3 pad 0.61)
  Top 0.146: PIC18F25K50.23 13.33,16.29 v12.21,17.41
  Bottom 0.146: v12.21,17.41 12.21,23.81 10.6,25.4 D3.1
N$27
  Bottom 0.146: D3.2 1.18,28.38 1.2,28.41 R13.2
N$28
  Bottom 0.146: N3.2 93.05,24.77 R5.1
N$29
  Top 0.146: D6.K R12.2
N$30
  Top 0.146: R15.2 D7.K
N$31  (via drill 0.35)
  Top 0.146: R16.2 19.85,20.48 22.37,23 31.59,23 32.27,23.69 32.27,23.81 v32.35,23.89
  Bottom 0.146: X3.2 65.88,34.04 64.59,32.75 61.98,32.75 60.81,33.92 56.34,33.92 53.9,36.36 41.05,36.36 40.61,35.93 40.61,32.78 39.12,31.28 35.2,31.28 34.26,31.28 33.43,30.44 33.43,24.96 v32.35,23.89
N$32
  Top 0.146: 19.85,16.22 19.85,15.22 17.67,13.03
  Top 0.152: R16.1 19.85,16.22 | 17.67,13.03 PIC18F25K50.21
N$33
  Top 0.146: X2.1 26.82,34.95 26.42,34.54 26.42,34.38 26.2,34.16 R9.1
N$34  (via drill 0.3 pad 0.61)
  Top 0.146: X2.2 29.39,36 26.66,36 26.11,35.46 R9.2 25.4,36.11 25.2,36.31 12.7,36.31 9.68,33.29 9.68,26.63 8.45,25.4 v8.45,24.42 | v8.45,15.99 9.17,15.99 9.26,15.99 10.41,15.99 10.82,15.58 10.82,13.87 PIC18F25K50.27
  Bottom 0.146: v8.45,24.42 v8.45,15.99
N$35  (via drill 0.3 pad 0.61)
  Top 0.146: T2.1 88.11,34.48 88.23,34.59 R14.1 88.23,36.41 88.02,36.61 7.72,36.61 4.47,33.36 4.47,25.52 v3.47,24.52 | PIC18F25K50.9 10.73,7.71 10.48,7.45 10.19,7.45 9.86,7.12 6.27,7.12 5.74,7.66 v4.09,7.66
  Bottom 0.146: v4.09,7.66 4.09,18.63 3.71,19.01 3.71,24.29 v3.47,24.52
N$38
  Top 0.127: USB1.1 5.04,4.43 | 5.04,4.43
  Top 0.146: USB1.1 5.04,4.43 5.04,5.63 4.2,6.47 D1.A
N$40  (via drill 0.3 pad 0.61)
  Top 0.146: v12.19,7.56 12.03,7.71 PIC18F25K50.11 | v14.33,6.34 14.33,4.51 15.12,3.71 C26.1
  Bottom 0.146: v14.33,6.34 13.41,6.34 v12.19,7.56
N$41  (via drill 0.3 pad 0.61, 0.35)
  Top 0.406: 1.53,11.54 0.71,11.54 0.51,11.74 0.51,16.75 VDD.TP | R10.1 1.53,11.54 | 1.53,11.54 D1.C 2.87,9.62 v3.15,9.89 | v18.08,3.7 18.13,3.74 C30.1 | U1.7 27.5,5.27 27.51,5.27 28.17,5.27 v28.71,4.73 | 19.05,8.01 19.91,8.88 v19.91,9.69
  Top 0.457: C30.1 19.05,8.01 16.63,10.43 PIC18F25K50.17
  Bottom 0.406: 73.28,36.11 95.05,36.11 X6.3 97.64,33.52 97.64,27.27 95.91,25.54 95.93,22.69 94.02,20.79 92.17,20.79 91.62,20.25 N3.1 | 73.28,36.11 69.83,36.11 X3.3 | N1.1 51.63,20.87 | 51.63,20.87 54.07,20.87 55.69,22.49 70.12,22.49 71.27,23.64 71.45,23.64 | X3.3 68.42,27.67 71.45,23.64 | 71.45,23.64 71.6,23.5 N2.1 | v3.15,9.89 3.15,3.09 3.96,2.27 8.84,2.27 10.26,3.7 v18.08,3.7 27.68,3.7 v28.71,4.73 33.18,9.19 X1.1 | R6.1 14.81,36.15 R7.2 17.21,36.17 19.61,33.77 35.6,33.77 X5.2 37.9,33.83 37.9,32.35 37.23,31.68 32.86,31.68 31.09,29.91 31.09,25.69 30.12,24.73 30.12,15.96 30.63,15.46 32.03,15.46 33.17,16.6 33.17,16.81 X1.1 | C10.+ 73.28,36.04 73.28,36.11 | X3.3 68.42,35.22 67.36,36.28 59.28,36.28 C11.+ | 51.63,20.87 51.63,20.96 49.34,23.25 36.13,23.25 34.36,21.48 34.36,20.51 33.18,19.33 X1.1
N$42  (via drill 0.3 pad 0.61)
  Top 0.146: v13.11,33.26 12.9,33.06 12.9,24.83 13.98,23.75 PIC18F25K50.22
  Bottom 0.146: BUTTON.3 11.31,33.67 11.72,33.26 v13.11,33.26 13.13,33.28 R6.2
  Bottom 0.406: BUTTON.4 BUTTON.3
N$43
  Bottom 0.146: R7.1 15.49,34.87 D2.A
N$44  (via drill 0.3 pad 0.61)
  Top 0.146: v1.12,32.04 1.12,26.45 0.61,25.95 0.61,19.34 1.02,18.94 2.64,18.94 3.05,18.53 3.05,16.6 | 3.05,16.6 3.05,16.09 2.81,15.86 MCLR.TP | 3.05,16.6 9.55,16.6 9.67,16.6 10.95,16.6 11.38,16.16 11.38,14.36 11.38,14.31 PIC18F25K50.26
  Bottom 0.146: RESET.3 5.21,33.06 6.05,32.21 D2.C | v1.12,32.04 1.11,32.05 RESET.4
  Bottom 0.406: RESET.3 RESET.4
N$45  (via drill 0.3 pad 0.61)
  Top 0.146: v11.38,7.56 11.38,8.26 11.38,8.27 PIC18F25K50.10 | v34.15,22.39 28.46,22.39 26.65,20.58 26.65,9.06 26.61,9.02 | 26.57,8.98 26.61,9.02 | 26.61,9.02 v26.61,9.06
  Bottom 0.146: v11.38,7.56 12.19,8.37 25.92,8.37 v26.61,9.06 | 35.15,24.83 35.51,25.18 | 35.51,25.18 36.78,26.45 38.61,26.45 41.86,29.71 X5.4 | v34.15,22.39 34.15,23.8 35.51,25.16 35.51,25.18
N$49
  Top 0.146: X6.4 100.38,34.69 100.91,35.22 R27.1
N$51
  Bottom 0.146: N1.2 53.94,23.91 R33.1
N$51_N
  Top 0.127: K3.5 59.44,23.74 59.86,24.16 59.86,24.6 52.93,24.6 52.69,24.82 49.25,24.82 47.89,26.18 47.89,26.77 47.34,27.32 J2.5
N$51_P
  Top 0.127: K3.6 61.44,23.55 60.44,24.55 60.44,24.61 60.28,24.85 54.03,24.85 53.81,25.08 49.35,25.08 48.15,26.28 48.15,26.77 48.69,27.32 J2.6
N$52  (via drill 0.3 pad 0.61)
  Top 0.146: v1.63,14.26 1.55,14.19 R10.2 2.74,12.84 3.85,11.73 PIC18F25K50.3 | v24.69,31.64 26.35,33.29 92.53,33.29 X6.2
  Bottom 0.146: v24.69,31.64 24.49,31.43 0.81,31.43 0.41,31.03 0.41,15.48 v1.63,14.26
N$52_N
  Top 0.127: K5.5 79.44,23.73 80.13,24.47 80.14,25.36 78.49,25.36 77.55,26.31 77.55,26.76 76.97,27.33 J3.5
N$52_P
  Top 0.127: K5.6 81.44,23.51 80.44,24.52 80.44,24.57 80.43,24.58 | 80.43,24.58 | J3.6 78.37,27.33 77.8,26.76 77.8,26.41 78.6,25.62 80.39,25.62 80.4,24.61 80.43,24.58 | 80.43,24.58
N$53_N
  Top 0.127: K7.5 99.43,24.22 101.19,24.7 101.42,25.25 101.43,25.27 102.36,26.2 106.58,26.2 106.97,26.59 106.97,26.73 J4.5
N$53_P
  Top 0.127: K7.6 101.43,24.4 101.68,25.16 102.47,25.95 106.68,25.95 107.15,26.41 107.45,26.41 J4.6
N$81_N
  Top 0.127: J2.8 53.43,27.32 54.01,26.73 54.01,26.31 54.45,25.87 55.63,25.87 55.67,25.91 66.44,25.91 K3.8
N$81_P
  Top 0.127: K3.9 67.44,24.21 67.57,25.09 67.57,25.14 66.89,26.17 55.58,26.17 55.53,26.12 54.56,26.12 54.38,26.3 54.38,26.36 54.27,26.47 54.27,26.73 54.85,27.32 J2.9
N$82_N
  Top 0.127: K5.8 85.44,24.18 87,24.73 86.14,25.6 84.22,25.6 83.7,26.12 83.7,26.64 83,27.33 J3.8
N$82_P
  Top 0.127: K5.9 87.44,23.59 87.32,24.72 87.32,24.77 87.24,24.85 | J3.9 84.65,27.33 83.95,26.64 83.95,26.23 84.33,25.85 86.24,25.85 87.24,24.85 | 87.24,24.85 87.25,24.84 | 87.24,24.85
N$83_N
  Top 0.127: J4.8 112.5,27.34 113.13,26.71 113.13,26.28 112.37,25.51 108.41,25.51 108.4,25.51 108.33,25.44 107.54,24.65 107.51,24.64 107.5,24.61 107.01,24.12 105.97,24.12 105.43,23.58 K7.8
N$83_P
  Top 0.127: K7.9 107.43,23.71 107.71,24.45 108.51,25.26 112.47,25.26 113.39,26.17 113.39,26.71 114.01,27.34 J4.9
N$85_N
  Top 0.127: USB1.2 5.69,5.04 6.83,6.18 9.73,6.18 11,4.91 11.53,4.91 12.85,6.24 12.85,7.71 12.73,7.84 12.73,8.34 PIC18F25K50.12
N$85_P
  Top 0.127: USB1.3 6.34,5.33 6.94,5.93 9.62,5.93 10.89,4.66 11.64,4.66 13.11,6.13 13.11,7.71 13.33,7.94 PIC18F25K50.13

### Text on the board
bPlace: XU4 Fan in | External Fan | RGB LED Header | LED/Power Button | GND | 1 | 2 | Odroid XU4 / Main Board | 5V | NC | Di | 5V | L+ | L- | PWM | GND | GND | PWR | Designed By LP / 12/31/2018
tNames: U1